# EAGLE design mcs_expansion (EAGLE 5.11)
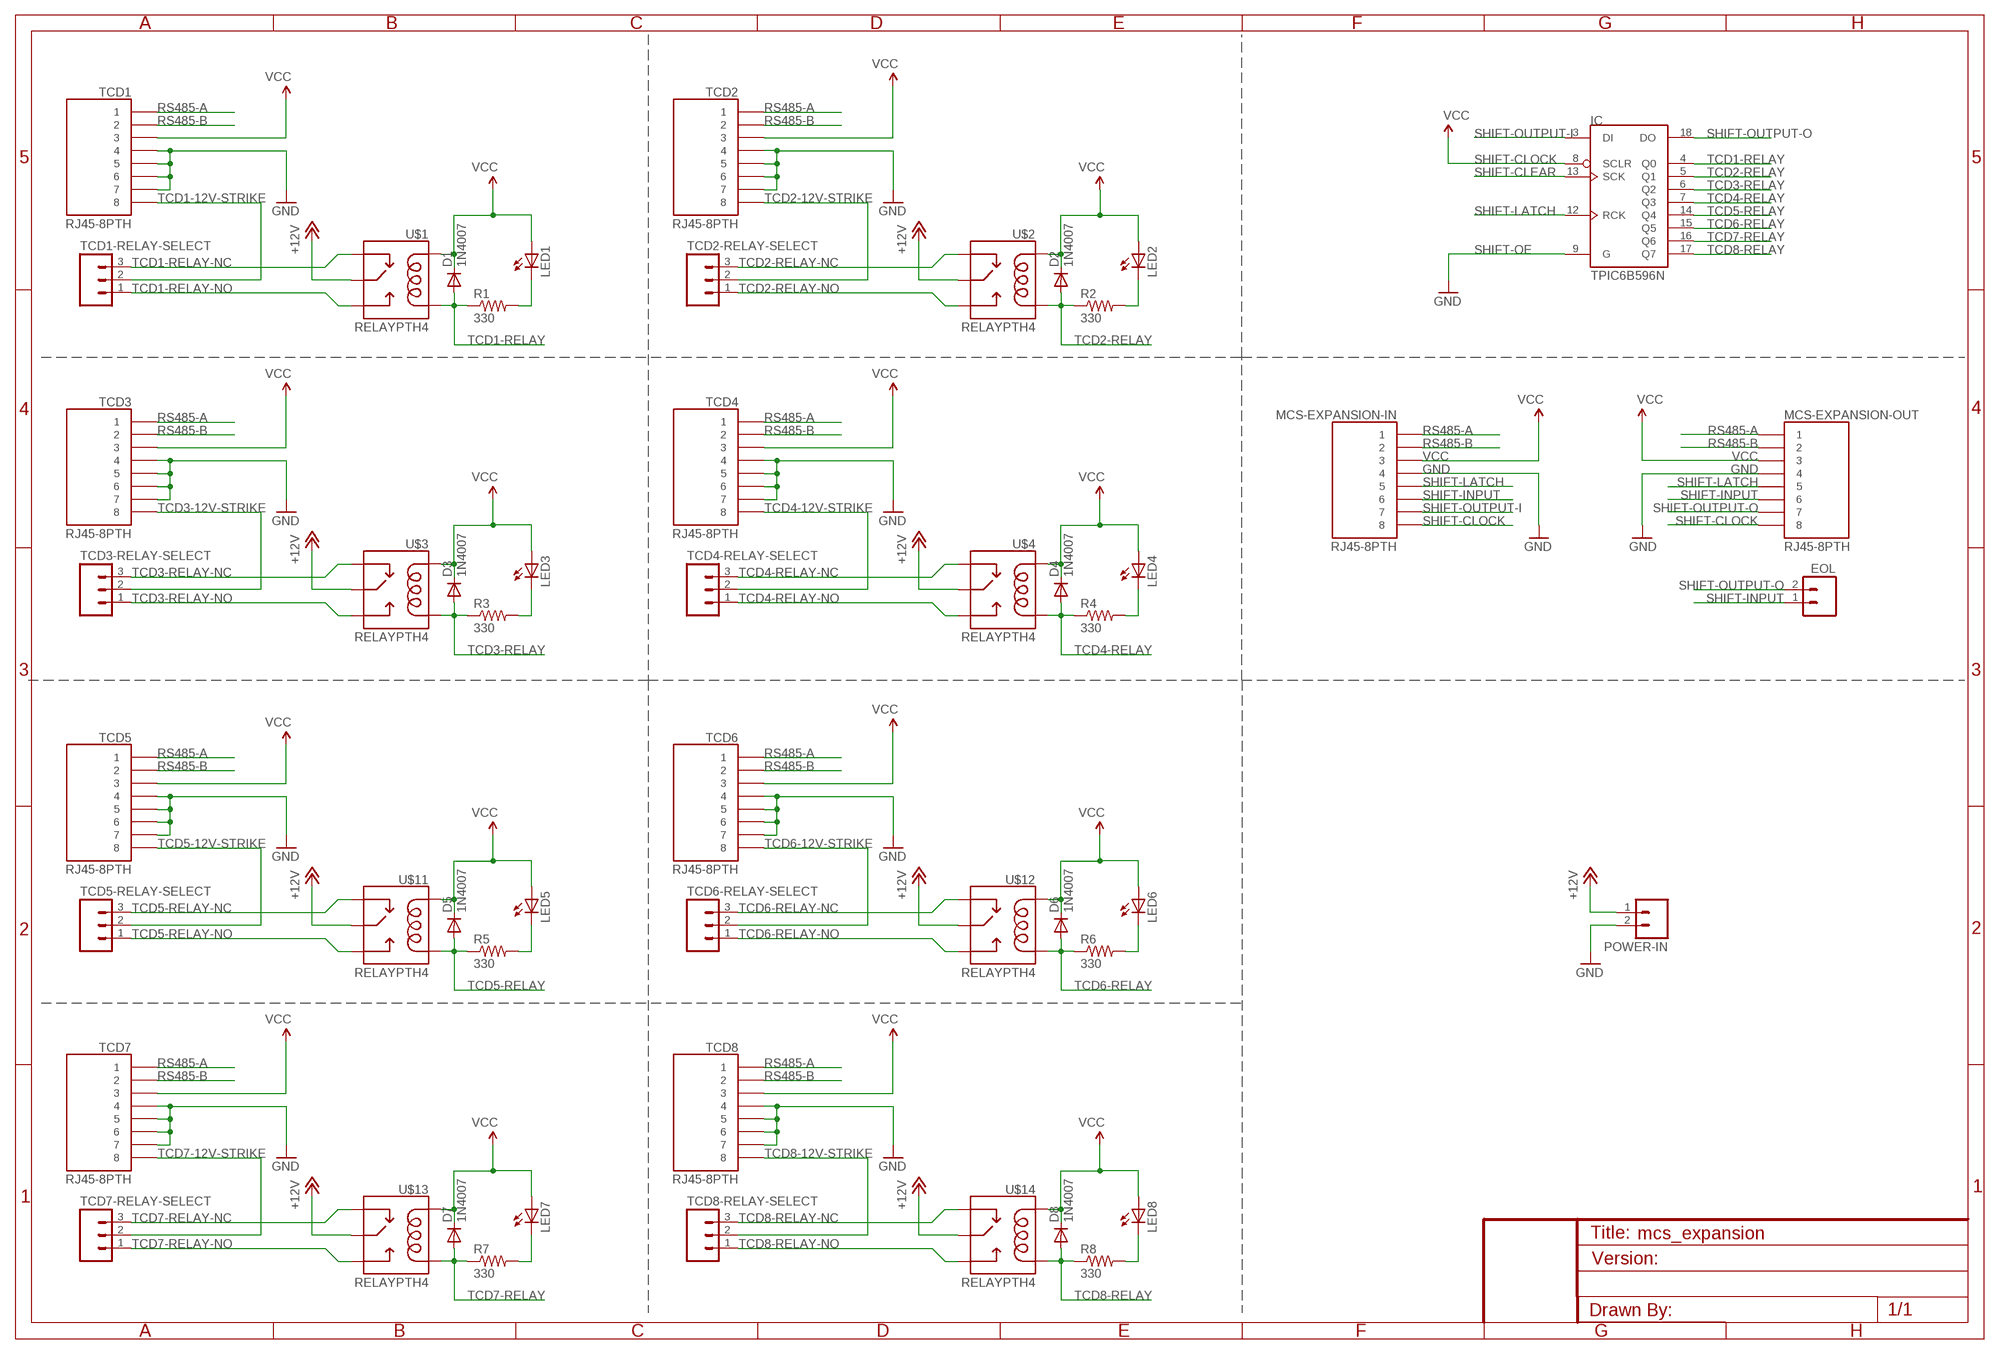
[diagram p0: schematic, sheet 1]

## Parts
D1  1N4007  DIODEPTH  [DIODE-1N4001]
D2  1N4007  DIODEPTH  [DIODE-1N4001]
D3  1N4007  DIODEPTH  [DIODE-1N4001]
D4  1N4007  DIODEPTH  [DIODE-1N4001]
D5  1N4007  DIODEPTH  [DIODE-1N4001]
D6  1N4007  DIODEPTH  [DIODE-1N4001]
D7  1N4007  DIODEPTH  [DIODE-1N4001]
D8  1N4007  DIODEPTH  [DIODE-1N4001]
EOL  M02PTH  [1X02]
IC  TPIC6B596N  [DIL20]
LED1  LED5MM  [LED5MM]
LED2  LED5MM  [LED5MM]
LED3  LED5MM  [LED5MM]
LED4  LED5MM  [LED5MM]
LED5  LED5MM  [LED5MM]
LED6  LED5MM  [LED5MM]
LED7  LED5MM  [LED5MM]
LED8  LED5MM  [LED5MM]
MCS-EXPANSION-IN  RJ45-8PTH  [RJ45-8]
MCS-EXPANSION-OUT  RJ45-8PTH  [RJ45-8]
POWER-IN  M023.5MM  [SCREWTERMINAL-3.5MM-2]
R1  330  RESISTORPTH-1/4W  [AXIAL-0.4]
R2  330  RESISTORPTH-1/4W  [AXIAL-0.4]
R3  330  RESISTORPTH-1/4W  [AXIAL-0.4]
R4  330  RESISTORPTH-1/4W  [AXIAL-0.4]
R5  330  RESISTORPTH-1/4W  [AXIAL-0.4]
R6  330  RESISTORPTH-1/4W  [AXIAL-0.4]
R7  330  RESISTORPTH-1/4W  [AXIAL-0.4]
R8  330  RESISTORPTH-1/4W  [AXIAL-0.4]
TCD1  RJ45-8PTH  [RJ45-8]
TCD1-RELAY-SELECT  M03PTH  [1X03]
TCD2  RJ45-8PTH  [RJ45-8]
TCD2-RELAY-SELECT  M03PTH  [1X03]
TCD3  RJ45-8PTH  [RJ45-8]
TCD3-RELAY-SELECT  M03PTH  [1X03]
TCD4  RJ45-8PTH  [RJ45-8]
TCD4-RELAY-SELECT  M03PTH  [1X03]
TCD5  RJ45-8PTH  [RJ45-8]
TCD5-RELAY-SELECT  M03PTH  [1X03]
TCD6  RJ45-8PTH  [RJ45-8]
TCD6-RELAY-SELECT  M03PTH  [1X03]
TCD7  RJ45-8PTH  [RJ45-8]
TCD7-RELAY-SELECT  M03PTH  [1X03]
TCD8  RJ45-8PTH  [RJ45-8]
TCD8-RELAY-SELECT  M03PTH  [1X03]
U$1  RELAYPTH4  [RELAY-JZC]
U$2  RELAYPTH4  [RELAY-JZC]
U$3  RELAYPTH4  [RELAY-JZC]
U$4  RELAYPTH4  [RELAY-JZC]
U$11  RELAYPTH4  [RELAY-JZC]
U$12  RELAYPTH4  [RELAY-JZC]
U$13  RELAYPTH4  [RELAY-JZC]
U$14  RELAYPTH4  [RELAY-JZC]

## Nets
+12V [signal]: POWER-IN.1 U$1.4(MAIN) U$2.4(MAIN) U$3.4(MAIN) U$4.4(MAIN) U$11.4(MAIN) U$12.4(MAIN) U$13.4(MAIN) U$14.4(MAIN)
GND: IC.9(G) MCS-EXPANSION-IN.4 MCS-EXPANSION-OUT.4 POWER-IN.2 TCD1.4 TCD1.5 TCD1.6 TCD1.7 TCD2.4 TCD2.5 TCD2.6 TCD2.7 TCD3.4 TCD3.5 TCD3.6 TCD3.7 TCD4.4 TCD4.5 TCD4.6 TCD4.7 TCD5.4 TCD5.5 TCD5.6 TCD5.7 TCD6.4 TCD6.5 TCD6.6 TCD6.7 TCD7.4 TCD7.5 TCD7.6 TCD7.7 TCD8.4 TCD8.5 TCD8.6 TCD8.7
N$1: LED1.K(C) R1.P$2
N$2: LED2.K(C) R2.P$2
N$3: LED3.K(C) R3.P$2
N$4: LED4.K(C) R4.P$2
N$5: LED5.K(C) R5.P$2
N$6: LED6.K(C) R6.P$2
N$7: LED7.K(C) R7.P$2
N$8: LED8.K(C) R8.P$2
RS485-A: MCS-EXPANSION-IN.1 MCS-EXPANSION-OUT.1 TCD1.1 TCD2.1 TCD3.1 TCD4.1 TCD5.1 TCD6.1 TCD7.1 TCD8.1
RS485-B: MCS-EXPANSION-IN.2 MCS-EXPANSION-OUT.2 TCD1.2 TCD2.2 TCD3.2 TCD4.2 TCD5.2 TCD6.2 TCD7.2 TCD8.2
SHIFT-CLOCK: IC.13(SCK) MCS-EXPANSION-IN.8 MCS-EXPANSION-OUT.8
SHIFT-INPUT: EOL.1 MCS-EXPANSION-IN.6 MCS-EXPANSION-OUT.6
SHIFT-LATCH: IC.12(RCK) MCS-EXPANSION-IN.5 MCS-EXPANSION-OUT.5
SHIFT-OUTPUT-I: IC.3(DI) MCS-EXPANSION-IN.7
SHIFT-OUTPUT-O: EOL.2 IC.18(DO) MCS-EXPANSION-OUT.7
TCD1-12V-STRIKE: TCD1-RELAY-SELECT.2 TCD1.8
TCD1-RELAY: D1.A IC.4(Q0) R1.P$1 U$1.1(COIL2)
TCD1-RELAY-NC: TCD1-RELAY-SELECT.3 U$1.2(NC)
TCD1-RELAY-NO: TCD1-RELAY-SELECT.1 U$1.3(NO)
TCD2-12V-STRIKE: TCD2-RELAY-SELECT.2 TCD2.8
TCD2-RELAY: D2.A IC.5(Q1) R2.P$1 U$2.1(COIL2)
TCD2-RELAY-NC: TCD2-RELAY-SELECT.3 U$2.2(NC)
TCD2-RELAY-NO: TCD2-RELAY-SELECT.1 U$2.3(NO)
TCD3-12V-STRIKE: TCD3-RELAY-SELECT.2 TCD3.8
TCD3-RELAY: D3.A IC.6(Q2) R3.P$1 U$3.1(COIL2)
TCD3-RELAY-NC: TCD3-RELAY-SELECT.3 U$3.2(NC)
TCD3-RELAY-NO: TCD3-RELAY-SELECT.1 U$3.3(NO)
TCD4-12V-STRIKE: TCD4-RELAY-SELECT.2 TCD4.8
TCD4-RELAY: D4.A IC.7(Q3) R4.P$1 U$4.1(COIL2)
TCD4-RELAY-NC: TCD4-RELAY-SELECT.3 U$4.2(NC)
TCD4-RELAY-NO: TCD4-RELAY-SELECT.1 U$4.3(NO)
TCD5-12V-STRIKE: TCD5-RELAY-SELECT.2 TCD5.8
TCD5-RELAY: D5.A IC.14(Q4) R5.P$1 U$11.1(COIL2)
TCD5-RELAY-NC: TCD5-RELAY-SELECT.3 U$11.2(NC)
TCD5-RELAY-NO: TCD5-RELAY-SELECT.1 U$11.3(NO)
TCD6-12V-STRIKE: TCD6-RELAY-SELECT.2 TCD6.8
TCD6-RELAY: D6.A IC.15(Q5) R6.P$1 U$12.1(COIL2)
TCD6-RELAY-NC: TCD6-RELAY-SELECT.3 U$12.2(NC)
TCD6-RELAY-NO: TCD6-RELAY-SELECT.1 U$12.3(NO)
TCD7-12V-STRIKE: TCD7-RELAY-SELECT.2 TCD7.8
TCD7-RELAY: D7.A IC.16(Q6) R7.P$1 U$13.1(COIL2)
TCD7-RELAY-NC: TCD7-RELAY-SELECT.3 U$13.2(NC)
TCD7-RELAY-NO: TCD7-RELAY-SELECT.1 U$13.3(NO)
TCD8-12V-STRIKE: TCD8-RELAY-SELECT.2 TCD8.8
TCD8-RELAY: D8.A IC.17(Q7) R8.P$1 U$14.1(COIL2)
TCD8-RELAY-NC: TCD8-RELAY-SELECT.3 U$14.2(NC)
TCD8-RELAY-NO: TCD8-RELAY-SELECT.1 U$14.3(NO)
VCC: D1.C D2.C D3.C D4.C D5.C D6.C D7.C D8.C IC.8(SCLR) LED1.A LED2.A LED3.A LED4.A LED5.A LED6.A LED7.A LED8.A MCS-EXPANSION-IN.3 MCS-EXPANSION-OUT.3 TCD1.3 TCD2.3 TCD3.3 TCD4.3 TCD5.3 TCD6.3 TCD7.3 TCD8.3 U$1.5(COIL1) U$2.5(COIL1) U$3.5(COIL1) U$4.5(COIL1) U$11.5(COIL1) U$12.5(COIL1) U$13.5(COIL1) U$14.5(COIL1)

## Notes on the sheet
- SHIFT-CLEAR
- SHIFT-OE

## Power pins joined to a net without a drawn wire
GND: IC.10(GND) IC.11(GND) IC.19(GND)
VCC: IC.2(VCC)

## Library data of the parts
D1-D8 = SparkFun:DIODE: Diode These are standard reverse protection diodes and small signal diodes. SMA package can handle up to about 1A. SOD-323 can handle about 200mA. What the SOD-323 package when ordering, there are some mfgs out there that are 5-pin packages.
EOL POWER-IN = SparkFun:M02: Header 2 Standard 2-pin 0.1" header. Use with straight break away headers (SKU : PRT-00116), right angle break away headers (PRT-00553), swiss pins (PRT-00743), machine pins (PRT-00117), and female headers (PRT-00115). Molex polarized connector foot print use with SKU : PRT-08233 with associated crimp pins and housings.
IC = tpic:TPIC6B596
LED1-LED8 = SparkFun:LED: LEDs Standard schematic elements and footprints for 5mm, 3mm, 1206, and 0603 sized LEDs. 5mm - Spark Fun Electronics SKU : COM-00529 (and others)
MCS-EXPANSION-IN MCS-EXPANSION-OUT TCD1-TCD8 = SparkFun:RJ45-8: RJ45 Jack Simple RJ45, 8-pin connection - connector for common Cat5, Cat5e, and Cat6 Ethernet cables. Footprint not yet proven in production. Connector sku is PRT-00643; Breakout PCB sku is BOB-00716.
R1-R8 = SparkFun:RESISTOR: Resistor Basic schematic elements and footprints for 0603, 1206, and PTH resistors.
TCD1-RELAY-SELECT TCD2-RELAY-SELECT TCD3-RELAY-SELECT TCD4-RELAY-SELECT TCD5-RELAY-SELECT TCD6-RELAY-SELECT TCD7-RELAY-SELECT TCD8-RELAY-SELECT = SparkFun:M03: Header 3 Standard 3-pin 0.1" header. Use with straight break away headers (SKU : PRT-00116), right angle break away headers (PRT-00553), swiss pins (PRT-00743), machine pins (PRT-00117), and female headers (PRT-00115). Molex polarized connector foot print use with SKU : PRT-08232 with associated crimp pins and housings.
U$1-U$4 U$11-U$14 = SparkFun:RELAY

## Net classes
2 signal: width 0.406 mm, clearance 0.305 mm

## Board
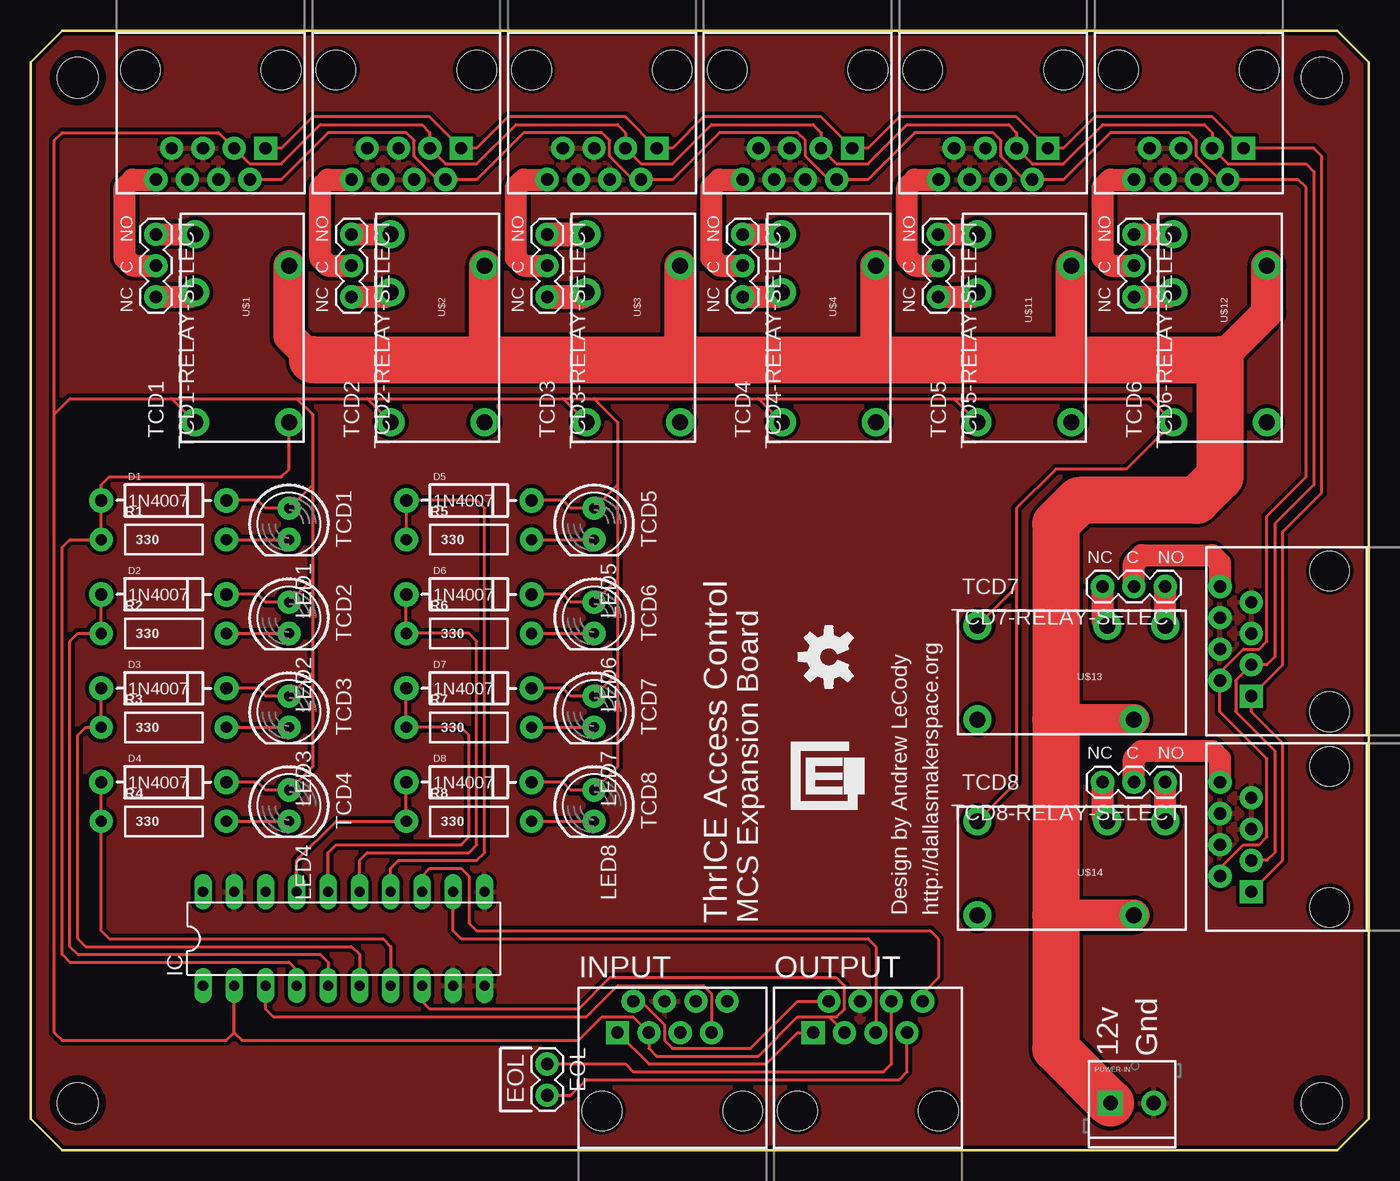
[diagram p1: board, top side]
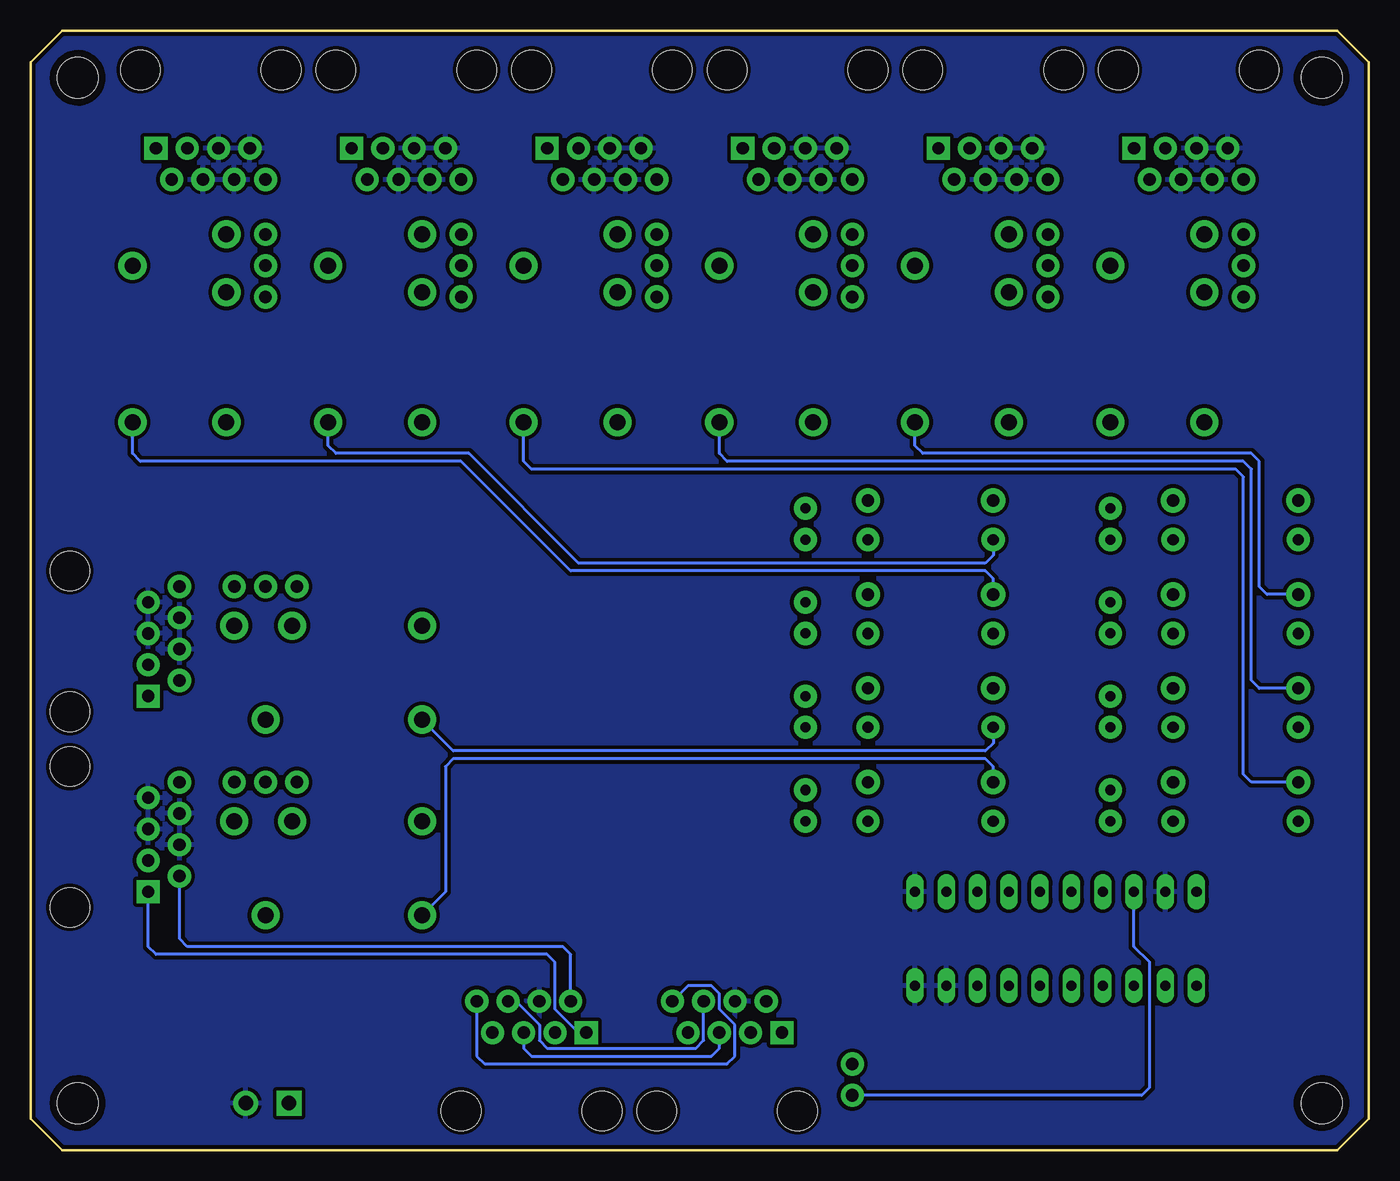
[diagram p2: board, bottom side, seen from below]

Size 108.58 x 90.81 mm. Coordinates in mm from the lower left corner, seen from the top.
Outline: 2.54,0 106.05,0 108.58,2.54 108.58,88.27 106.03,90.8 100,90.8 2.54,90.81 0,88.27 0,2.54 2.54,0
Copper layers (1*16): Top 0.035mm / dielectric 1.5mm / Bottom 0.035mm
Design rules "SparkFun": minimum track width 8mil, minimum drill 20mil, track to track 8mil, track to pad 8mil, pad to pad 8mil, via to via 8mil, smd to smd 8mil, copper to edge 10mil, drill to drill 8mil, minimum pad ring 12mil, minimum via ring 10mil, stop-mask expansion 4mil, vias tented up to drill 25mil, thermal gap 10mil

### Footprints (pad centres in the part's own frame; a part is rotated, then mirrored left to right if it is on the bottom)
DIODE-1N4001 = drill 1 pad 1.981 round: A -5.08,0; C 5.08,0
1X02 = drill 1.016 pad 1.88 round: 1 0,0; 2 2.54,0
DIL20 = drill 0.813 long: 1 -11.43,-3.81; 2 -8.89,-3.81; 3 -6.35,-3.81; 4 -3.81,-3.81; 5 -1.27,-3.81; 6 1.27,-3.81; 7 3.81,-3.81; 8 6.35,-3.81; 9 8.89,-3.81; 10 11.43,-3.81; 11 11.43,3.81; 12 8.89,3.81; 13 6.35,3.81; 14 3.81,3.81; 15 1.27,3.81; 16 -1.27,3.81; 17 -3.81,3.81; 18 -6.35,3.81; 19 -8.89,3.81; 20 -11.43,3.81
LED5MM = drill 0.813 pad 1.88 round: A -1.27,0; K 1.27,0
RJ45-8 = drill 1 pad 1.88 square: 1 -4.445,6.35 | drill 1 pad 1.88 round: 2 -3.175,8.89; 3 -1.905,6.35; 4 -0.635,8.89; 5 0.635,6.35; 6 1.905,8.89; 7 3.175,6.35; 8 4.445,8.89 | hole 3.2: -5.715,0; 5.715,0
SCREWTERMINAL-3.5MM-2 = drill 1.2 pad 2.032 square: 1 0,0 | drill 1.2 pad 2.032 round: 2 3.5,0
AXIAL-0.4 = drill 0.9 pad 1.88 round: P$1 -5.08,0; P$2 5.08,0
1X03 = drill 1.016 pad 1.88 round: 1 0,0; 2 2.54,0; 3 5.08,0
RELAY-JZC = drill 1.3 pad 2.286 round: 1 3.81,-8.89; 2 -3.81,1.651; 3 -3.81,6.35; 4 3.81,3.81; 5 -3.81,-8.89
STAND-OFF = hole 3.302: 0,0

### Placement (x,y rotation side)
D1  10.79,52.7 0 top
D2  10.79,45.09 0 top
D3  10.79,37.47 0 top
D4  10.79,29.84 0 top
D5  35.56,52.7 0 top
D6  35.56,45.09 0 top
D7  35.56,37.47 0 top
D8  35.56,29.84 0 top
EOL  41.91,6.99 270 top
IC  25.4,17.14 0 top
LED1  20.95,50.8 270 top
LED2  20.95,43.18 270 top
LED3  20.95,35.56 270 top
LED4  20.95,27.94 270 top
LED5  45.72,50.8 270 top
LED6  45.72,43.18 270 top
LED7  45.72,35.56 270 top
LED8  45.72,27.94 270 top
MCS-EXPANSION-IN  52.07,3.17 0 top
MCS-EXPANSION-OUT  67.94,3.17 0 top
POWER-IN  87.63,3.81 0 top
R1  10.79,49.53 0 top
R2  10.79,41.91 0 top
R3  10.79,34.29 0 top
R4  10.79,26.67 0 top
R5  35.56,49.53 0 top
R6  35.56,41.91 0 top
R7  35.56,34.29 0 top
R8  35.56,26.67 0 top
TCD1  14.61,87.63 180 top
TCD1-RELAY-SELECT  10.16,74.3 270 top
TCD2  30.48,87.63 180 top
TCD2-RELAY-SELECT  26.04,74.3 270 top
TCD3  46.35,87.63 180 top
TCD3-RELAY-SELECT  41.91,74.3 270 top
TCD4  62.23,87.63 180 top
TCD4-RELAY-SELECT  57.78,74.3 270 top
TCD5  78.11,87.63 180 top
TCD5-RELAY-SELECT  73.66,74.3 270 top
TCD6  93.98,87.63 180 top
TCD6-RELAY-SELECT  89.53,74.3 270 top
TCD7  105.41,41.27 90 top
TCD7-RELAY-SELECT  92.08,45.72 180 top
TCD8  105.41,25.4 90 top
TCD8-RELAY-SELECT  92.08,29.84 180 top
U$1  17.14,67.94 0 top
U$2  33.02,67.94 0 top
U$3  48.9,67.94 0 top
U$4  64.77,67.94 0 top
U$5  [STAND-OFF]  3.81,87 0 top
U$6  [STAND-OFF]  104.78,87 0 top
U$7  [STAND-OFF]  104.78,3.81 0 top
U$8  [STAND-OFF]  3.81,3.81 0 top
U$9  [DMS-LOGO]  67.94,27.3 90 top
U$10  [OSHW-LOGO-M]  64.77,40.01 90 top
U$11  80.64,67.94 0 top
U$12  96.52,67.94 0 top
U$13  85.72,38.73 270 top
U$14  85.72,22.86 270 top

### Tracks (layer width: path | path; a pad name or v marks a point on that pad's centre or on a via)
+12V
  Top 2.54: 36.83,64.14 U$2.4 | 52.7,64.14 U$3.4 | 68.58,64.14 U$4.4 | 84.45,64.14 U$11.4 | 83.19,19.05 U$14.4 | 83.19,34.92 U$13.4 | 96.52,64.14 100.33,67.94 U$12.4 | U$1.4 20.95,66.04 22.86,64.14
  Top 3.81: POWER-IN.1 83.19,8.26 83.19,19.05 83.19,34.92 83.19,50.8 85.09,52.7 94.61,52.7 96.52,54.61 96.52,64.14 84.45,64.14 68.58,64.14 52.7,64.14 36.83,64.14 22.86,64.14
GND
  pour Bottom (isolate 0.305): -1.91,-1.91 -1.91,93.98 111.12,93.98 111.12,-1.91
  pour Top (isolate 0.305): -3.81,96.52 113.67,96.52 113.67,-3.81 -3.81,-3.81
N$1
  Top 0.254: R1.P$2 LED1.K
N$2
  Top 0.254: R2.P$2 LED2.K
N$3
  Top 0.254: R3.P$2 LED3.K
N$4
  Top 0.254: R4.P$2 LED4.K
N$5
  Top 0.254: R5.P$2 LED5.K
N$6
  Top 0.254: R6.P$2 LED6.K
N$7
  Top 0.254: R7.P$2 LED7.K
N$8
  Top 0.254: R8.P$2 LED8.K
RS485-A
  Top 0.254: TCD8.1 101.6,23.5 101.6,33.02 99.06,35.56 TCD7.1 101.6,39.37 101.6,50.16 104.78,53.34 104.78,80.64 104.14,81.28 TCD6.1 95.89,83.82 86.36,83.82 83.82,81.28 TCD5.1 80.01,83.82 70.48,83.82 67.94,81.28 TCD4.1 64.14,83.82 54.61,83.82 52.07,81.28 TCD3.1 48.26,83.82 38.73,83.82 36.2,81.28 TCD2.1 32.38,83.82 22.86,83.82 20.32,81.28 TCD1.1 | MCS-EXPANSION-OUT.1 62.23,9.53 59.69,6.99 50.16,6.99 MCS-EXPANSION-IN.1
  Bottom 0.254: TCD8.1 99.06,16.51 98.42,15.88 66.67,15.88 66.04,15.24 66.04,11.43 64.14,9.53 MCS-EXPANSION-OUT.1
RS485-B
  Top 0.254: TCD1.2 20.32,78.74 24.13,82.55 30.48,82.55 31.11,81.92 31.11,80.64 33.02,78.74 TCD2.2 36.2,78.74 40.01,82.55 46.35,82.55 46.99,81.92 46.99,80.64 48.9,78.74 TCD3.2 52.07,78.74 55.88,82.55 62.23,82.55 62.87,81.92 62.87,80.64 64.77,78.74 TCD4.2 67.94,78.74 71.75,82.55 78.11,82.55 78.74,81.92 78.74,80.64 80.64,78.74 TCD5.2 83.82,78.74 87.63,82.55 93.98,82.55 94.61,81.92 94.61,80.64 96.52,78.74 TCD6.2 102.87,78.74 103.5,78.11 103.5,54.61 100.33,51.44 100.33,41.27 99.69,40.64 98.42,40.64 96.52,38.73 TCD7.2 96.52,35.56 100.33,31.75 100.33,25.4 99.69,24.77 98.42,24.77 96.52,22.86 TCD8.2 | MCS-EXPANSION-OUT.2 62.23,12.06 58.42,8.26 52.07,8.26 51.44,8.89 51.44,10.16 49.53,12.06 MCS-EXPANSION-IN.2
  Bottom 0.254: TCD8.2 96.52,17.14 95.89,16.51 65.41,16.51 64.77,15.88 MCS-EXPANSION-OUT.2
SHIFT-CLOCK
  Top 0.254: MCS-EXPANSION-OUT.8 72.39,12.7 73.66,13.97 73.66,17.14 73.03,17.78 36.2,17.78 35.56,18.41 35.56,22.23 34.92,22.86 32.38,22.86 31.75,22.23 IC.13
  Bottom 0.254: MCS-EXPANSION-OUT.8 72.39,7.62 71.75,6.99 52.07,6.99 51.44,7.62 51.44,10.16 52.7,11.43 52.7,12.7 53.34,13.34 55.24,13.34 MCS-EXPANSION-IN.8
SHIFT-INPUT
  Top 0.254: EOL.1 48.26,6.99 48.9,6.35 69.22,6.35 69.85,6.99 MCS-EXPANSION-OUT.6
  Bottom 0.254: MCS-EXPANSION-IN.6 53.98,8.89 54.61,8.26 66.67,8.26 67.31,8.89 67.31,10.16 69.22,12.06 MCS-EXPANSION-OUT.6
SHIFT-LATCH
  Top 0.254: MCS-EXPANSION-OUT.5 68.58,16.51 67.94,17.14 34.92,17.14 34.29,17.78 IC.12
  Bottom 0.254: MCS-EXPANSION-IN.5 52.7,8.26 53.34,7.62 67.94,7.62 68.58,8.26 MCS-EXPANSION-OUT.5
SHIFT-OUTPUT-I
  Top 0.254: MCS-EXPANSION-IN.7 55.24,12.7 54.61,13.34 47.62,13.34 45.09,10.79 19.68,10.79 19.05,11.43 IC.3
SHIFT-OUTPUT-O
  Top 0.254: MCS-EXPANSION-OUT.7 71.12,6.35 70.48,5.71 45.09,5.71 43.81,4.45 EOL.2
  Bottom 0.254: IC.18 19.05,16.51 17.78,15.24 17.78,5.08 18.41,4.45 EOL.2
TCD1-12V-STRIKE
  Top 1.778: TCD1-RELAY-SELECT.2 8.26,71.75 7.62,72.39 7.62,78.11 8.26,78.74 TCD1.8
TCD1-RELAY
  Top 0.254: U$1.1 20.95,55.24 20.32,54.61 6.35,54.61 5.71,53.98 D1.A R1.P$1 3.17,49.53 2.54,48.9 2.54,15.88 3.17,15.24 20.95,15.24 21.59,14.61 IC.4
TCD1-RELAY-NC
  Top 1.778: TCD1-RELAY-SELECT.3 12.95,69.22 U$1.2
TCD1-RELAY-NO
  Top 1.778: TCD1-RELAY-SELECT.1 U$1.3
TCD2-12V-STRIKE
  Top 1.778: TCD2-RELAY-SELECT.2 24.13,71.75 23.5,72.39 23.5,78.11 24.13,78.74 TCD2.8
TCD2-RELAY
  Top 0.254: D2.A R2.P$1 3.81,41.91 3.17,41.27 3.17,16.51 3.81,15.88 23.5,15.88 24.13,15.24 IC.5
  Bottom 0.254: U$2.1 36.83,57.15 36.2,56.52 9.53,56.52 8.89,55.88 8.89,45.72 8.26,45.09 D2.A
TCD2-RELAY-NC
  Top 1.778: TCD2-RELAY-SELECT.3 28.83,69.22 U$2.2
TCD2-RELAY-NO
  Top 1.778: TCD2-RELAY-SELECT.1 U$2.3
TCD3-12V-STRIKE
  Top 1.778: TCD3-RELAY-SELECT.2 40.01,71.75 39.37,72.39 39.37,78.11 40.01,78.74 TCD3.8
TCD3-RELAY
  Top 0.254: D3.A R3.P$1 4.45,34.29 3.81,33.66 3.81,17.14 4.45,16.51 26.04,16.51 26.67,15.88 IC.6
  Bottom 0.254: U$3.1 52.7,56.52 52.07,55.88 10.16,55.88 9.53,55.24 9.53,38.1 8.89,37.47 D3.A
TCD3-RELAY-NC
  Top 1.93: TCD3-RELAY-SELECT.3 44.7,69.22 U$3.2
TCD3-RELAY-NO
  Top 1.93: TCD3-RELAY-SELECT.1 U$3.3
TCD4-12V-STRIKE
  Top 1.778: TCD4-RELAY-SELECT.2 55.88,71.75 55.24,72.39 55.24,78.11 55.88,78.74 TCD4.8
TCD4-RELAY
  Top 0.254: D4.A R4.P$1 5.71,17.78 6.35,17.14 28.57,17.14 29.21,16.51 IC.7
  Bottom 0.254: U$4.1 68.58,55.88 67.94,55.24 10.79,55.24 10.16,54.61 10.16,30.48 9.53,29.84 D4.A
TCD4-RELAY-NC
  Top 1.778: TCD4-RELAY-SELECT.3 60.58,69.22 U$4.2
TCD4-RELAY-NO
  Top 1.778: TCD4-RELAY-SELECT.1 U$4.3
TCD5-12V-STRIKE
  Top 1.778: TCD5-RELAY-SELECT.2 71.75,71.75 71.12,72.39 71.12,78.11 71.75,78.74 TCD5.8
TCD5-RELAY
  Top 0.254: R5.P$1 D5.A 36.2,52.7 36.83,52.07 36.83,24.13 36.2,23.5 29.84,23.5 29.21,22.86 IC.14
  Bottom 0.254: U$11.1 84.45,57.15 83.82,56.52 73.03,56.52 64.14,47.62 31.11,47.62 30.48,48.26 R5.P$1
TCD5-RELAY-NC
  Top 1.778: TCD5-RELAY-SELECT.3 76.45,69.22 U$11.2
TCD5-RELAY-NO
  Top 1.778: TCD5-RELAY-SELECT.1 U$11.3
TCD6-12V-STRIKE
  Top 1.778: TCD6-RELAY-SELECT.2 87.63,71.75 87,72.39 87,78.11 87.63,78.74 TCD6.8
TCD6-RELAY
  Top 0.254: D6.A R6.P$1 35.56,41.91 36.2,41.27 36.2,24.77 35.56,24.13 27.3,24.13 26.67,23.5 IC.15
  Bottom 0.254: U$12.1 100.33,56.52 99.69,55.88 73.66,55.88 64.77,46.99 31.11,46.99 30.48,46.35 D6.A
TCD6-RELAY-NC
  Top 1.778: TCD6-RELAY-SELECT.3 92.33,69.22 U$12.2
TCD6-RELAY-NO
  Top 1.778: TCD6-RELAY-SELECT.1 U$12.3
TCD7-12V-STRIKE
  Top 1.778: TCD7-RELAY-SELECT.2 89.53,47.62 90.17,48.26 95.89,48.26 96.52,47.62 TCD7.8
TCD7-RELAY
  Top 0.254: D7.A R7.P$1 34.92,34.29 35.56,33.66 35.56,25.4 34.92,24.77 24.77,24.77 24.13,24.13 IC.16
  Bottom 0.254: R7.P$1 30.48,33.02 31.11,32.38 74.3,32.38 U$13.1
TCD7-RELAY-NC
  Top 1.778: TCD7-RELAY-SELECT.3 87,42.93 U$13.2
TCD7-RELAY-NO
  Top 1.778: U$13.3 TCD7-RELAY-SELECT.1
TCD8-12V-STRIKE
  Top 1.778: TCD8-RELAY-SELECT.2 89.53,31.75 90.17,32.38 95.89,32.38 96.52,31.75 TCD8.8
TCD8-RELAY
  Top 0.254: D8.A R8.P$1 24.77,26.67 21.59,23.5 IC.17
  Bottom 0.254: U$14.1 74.93,20.95 74.93,31.11 74.3,31.75 31.11,31.75 30.48,31.11 D8.A
TCD8-RELAY-NC
  Top 1.778: TCD8-RELAY-SELECT.3 87,27.05 U$14.2
TCD8-RELAY-NO
  Top 1.778: U$14.3 TCD8-RELAY-SELECT.1
VCC
  Top 0.254: TCD8.3 100.33,23.5 100.97,24.13 100.97,32.38 97.79,35.56 97.79,38.1 TCD7.3 100.33,39.37 100.97,40.01 100.97,50.8 104.14,53.98 104.14,79.38 103.5,80.01 97.16,80.01 TCD6.3 95.89,82.55 95.25,83.19 87,83.19 83.82,80.01 81.28,80.01 TCD5.3 80.01,82.55 79.38,83.19 71.12,83.19 67.94,80.01 65.41,80.01 TCD4.3 64.14,82.55 63.5,83.19 55.24,83.19 52.07,80.01 49.53,80.01 TCD3.3 48.26,82.55 47.62,83.19 39.37,83.19 36.2,80.01 33.66,80.01 TCD2.3 32.38,82.55 31.75,83.19 23.5,83.19 20.32,80.01 17.78,80.01 TCD1.3 15.24,82.55 2.54,82.55 1.91,81.92 1.91,59.69 | 64.77,10.79 MCS-EXPANSION-OUT.3 | 64.77,10.79 62.23,10.79 59.05,7.62 50.8,7.62 50.16,8.26 MCS-EXPANSION-IN.3 48.9,10.79 46.35,10.79 44.45,8.89 17.14,8.89 16.51,9.53 | 64.77,10.79 65.41,10.79 66.04,11.43 66.04,13.34 65.41,13.97 46.99,13.97 44.45,11.43 32.38,11.43 31.75,12.06 IC.8 | 16.51,9.53 IC.2 | 16.51,9.53 15.88,8.89 2.54,8.89 1.91,9.53 1.91,59.69 | D1.C 18.41,52.7 19.05,52.07 LED1.A 22.86,53.98 | D3.C 18.41,37.47 19.05,36.83 LED3.A 22.86,38.73 | D7.C 43.18,37.47 43.81,36.83 LED7.A 47.62,38.73 | D4.C 18.41,29.84 19.05,29.21 LED4.A 22.86,31.11 22.86,38.73 | D2.C 18.41,45.09 19.05,44.45 LED2.A 22.86,46.35 | D5.C 43.18,52.7 43.81,52.07 LED5.A 47.62,53.98 | D6.C 43.18,45.09 43.81,44.45 LED6.A 47.62,46.35 | D8.C 43.18,29.84 43.81,29.21 LED8.A 47.62,31.11 47.62,38.73 | 22.86,46.35 22.86,38.73 | 47.62,46.35 47.62,38.73 | 1.91,59.69 3.17,60.96 11.43,60.96 | 11.43,60.96 21.59,60.96 | 21.59,60.96 27.3,60.96 | 27.3,60.96 43.18,60.96 | 43.18,60.96 45.72,60.96 | 45.72,60.96 59.05,60.96 | 59.05,60.96 74.93,60.96 | 74.93,60.96 90.81,60.96 U$12.5 88.9,55.24 83.19,55.24 80.01,52.07 80.01,45.72
  Top 0.254: 11.43,60.96 U$1.5 | 27.3,60.96 U$2.5 | 22.86,53.98 22.86,59.69 21.59,60.96 | 22.86,53.98 22.86,46.35 | 43.18,60.96 U$3.5 | 59.05,60.96 U$4.5 | 74.93,60.96 U$11.5 | 47.62,53.98 47.62,59.05 45.72,60.96 | 47.62,53.98 47.62,46.35 | 80.01,45.72 U$13.5 | U$14.5 80.01,29.84 80.01,45.72

### Text on the board
tPlace: NO | NO | NO | NO | NO | NO | C | C | C | C | C | C | NC | NC | NC | NC | NC | NC | TCD1 | TCD2 | TCD3 | TCD4 | TCD5 | TCD6 | TCD1 | TCD5 | NC | C | NO | TCD7 | TCD2 | TCD6 | TCD3 | TCD7 | NC | C | NO | TCD8 | TCD4 | TCD8 | Design by Andrew LeCody | http://dallasmakerspace.org | ThrICE Access Control | MCS Expansion Board | INPUT | OUTPUT | 12v | Gnd | EOL